# Altium schematic sheet 辉光钟_底板.SchDoc: 辉光钟
size A3; Date: 2016/12/31; CheckedBy: dudu; Author: dudu; Time: 2016/12/31; DocumentName: 辉光钟原理图
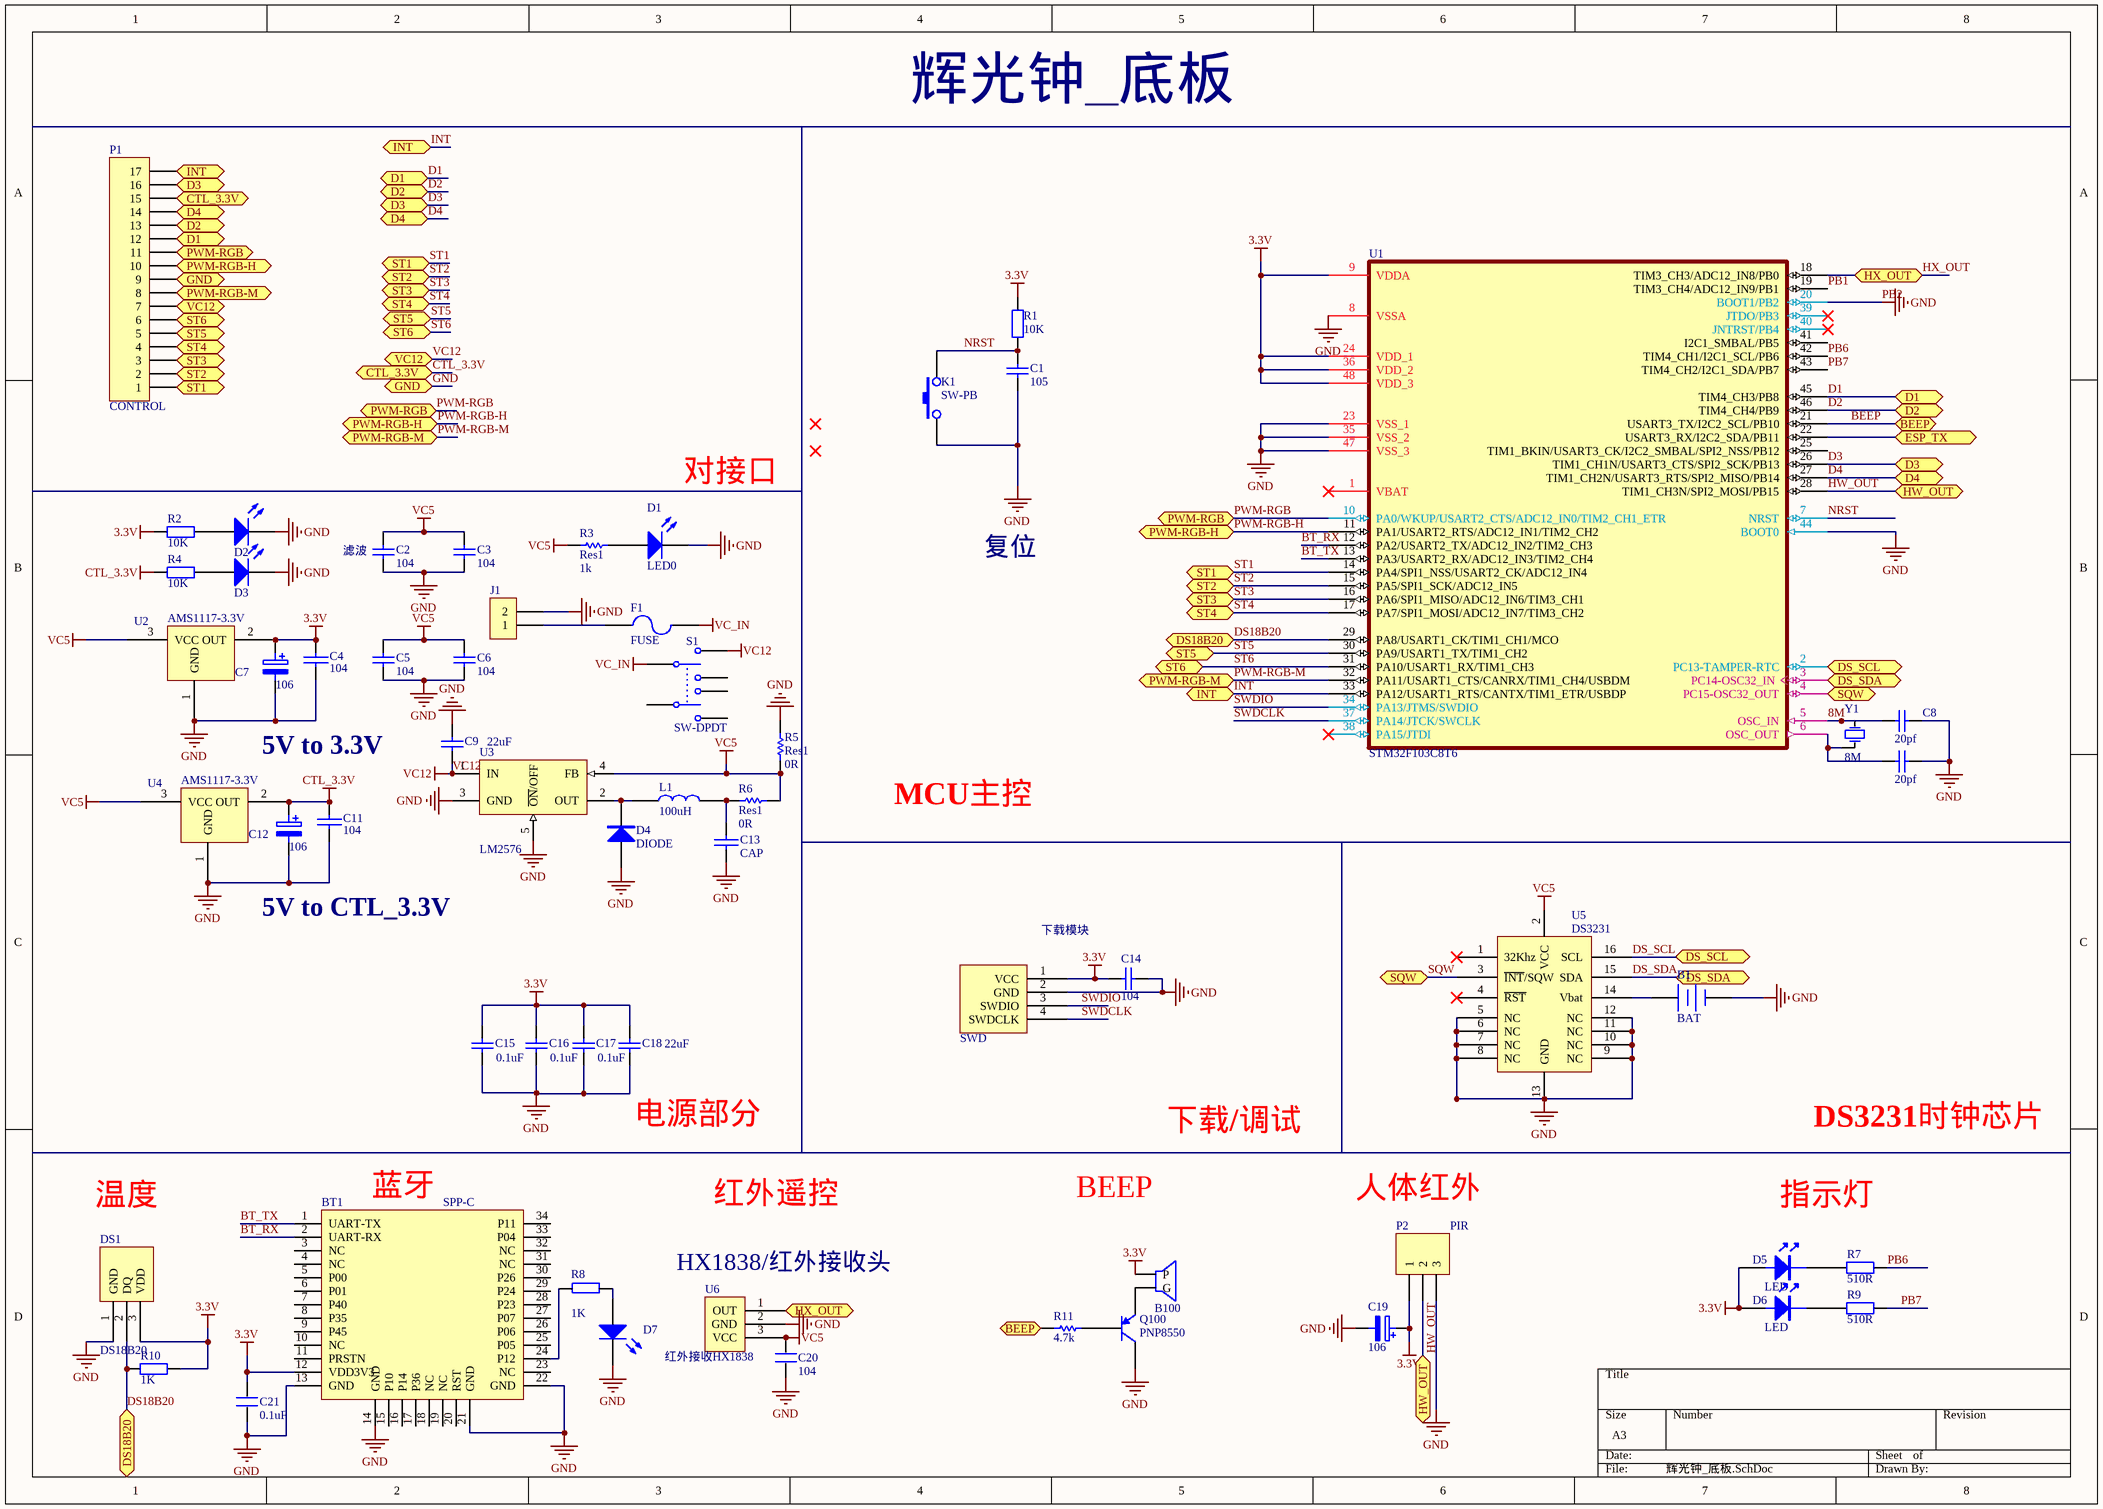
[diagram p0: 辉光钟_底板.SchDoc]

## Parts
B1  BAT  [CR1220_B]
B100  BEEP  [BELL-SMALL]  (value not drawn)
BT1  SPP-C  [CC2540/2541]
C1  105  [0603C]
C2  value 104  [0603C]  (hidden comment: Cap)
C3  value 104  [0603C]  (hidden comment: Cap)
C4  104  [0603C]
C5  value 104  [0603C]  (hidden comment: Cap)
C6  value 104  [0603C]  (hidden comment: Cap)
C7  106  [0603C]
C8  value 20pf  [0603C]  (hidden comment: Cap)
C9  value 22uF  [CD4]  (hidden comment: Cap)
C10  value 20pf  [0603C]  (hidden comment: Cap)
C11  104  [0603C]
C12  106  [0603C]
C13  CAP  [CS 5.0*10*13 - C]
C14  104  [0603C]
C15  value 0.1uF  [0603C]  (hidden comment: Cap)
C16  value 0.1uF  [0603C]  (hidden comment: Cap)
C17  value 0.1uF  [0603C]  (hidden comment: Cap)
C18  value 22uF  [0603C]  (hidden comment: Cap)
C19  106  [0603C]
C20  104  [0603C]
C21  value 0.1uF  [0603C]
D1  LED0  [0805_LED]
D2  LED0  [0805_LED]  (value not drawn)
D3  LED0  [0805_LED]  (value not drawn)
D4  DIODE  [DO-27]
D5  LED  [0805_LED]
D6  LED  [0805_LED]
D7  LED0  [0805LED]  (value not drawn)
DS1  DS18B20  [HDR1X3]
F1  FUSE  [FUSE]
J1  CON2  [DC10B]  (value not drawn)
K1  SW-PB  [KEY_M]
L1  100uH  [电感]
P1  CONTROL  [QS30_shape]
P2  PIR  [HDR1X3]
Q100  PNP8550  [NPN8050 SOT23R]
R1  10K  [0603R]
R2  value 10K  [0603R]  (hidden comment: Res1)
R3  Res1  value 1k  [0603R]
R4  value 10K  [0603R]  (hidden comment: Res1)
R5  Res1  value 0R  [0603R]
R6  Res1  value 0R  [0603R]
R7  510R  [0603R]
R8  value 1K  [0603R]
R9  510R  [0603R]
R10  value 1K  [0603R]  (hidden comment: Res1)
R11  4.7k  [0603R]
S1  SW-DPDT  [单刀双掷开关]
SWD1  SWD  [XH2.54-4]
U1  STM32F103C8T6  [STM-LQFP48_M]
U2  AMS1117-3.3V  [AMS1117_SOT223]
U3  LM2576  [TO-263-5]
U4  AMS1117-3.3V  [AMS1117_SOT223]
U5  DS3231  [SOIC-16 300mil]
U6  红外接收HX1838  [红外HX1838]
Y1  value 8M  [XTAL-12M]  (hidden comment: XTAL)

## Ports
BEEP (bidir), CTL_3.3V (bidir), D1 (bidir), D2 (bidir), D3 (bidir), D4 (bidir), DS18B20 (bidir), DS_SCL (bidir), DS_SDA (bidir), ESP_TX (bidir), GND (bidir), HW_OUT (bidir), HX_OUT (bidir), INT (bidir), PWM-RGB (bidir), PWM-RGB-H (bidir), PWM-RGB-M (bidir), SQW (bidir), ST1 (bidir), ST2 (bidir), ST3 (bidir), ST4 (bidir), ST5 (bidir), ST6 (bidir), VC12 (bidir)

## Nets
3.3V: B100.1(P) BT1.12(VDD3V3) C4.1 C7.1 C14.1 C15.2 C16.2 C17.2 C18.2 C19.1 C21.2 D5.1 D6.1 DS1.3(VDD) P2.1 R1.2 R2.2 R10.2 SWD1.1(VCC) U1.9(VDDA) U1.24(VDD_1) U1.36(VDD_2) U1.48(VDD_3) U2.2(OUT)
CTL_3.3V: C11.1 C12.1 P1.15 R4.2 U4.2(OUT) ; port CTL_3.3V
GND: B1.2(-) BT1.13(GND) BT1.14(GND) BT1.21(GND) BT1.22(GND) C1.1 C2.1 C3.1 C4.2 C5.1 C6.1 C7.2 C8.1 C9.2 C10.1 C11.2 C12.2 C13.2 C14.2 C15.1 C16.1 C17.1 C18.1 C19.2 C20.1 C21.1 D1.2(K) D2.2(K) D3.2(K) D4.A D7.2(K) DS1.1(GND) J1.2 K1.1 P1.9 P2.3 Q100.3(C) R5.2 SWD1.2(GND) U1.8(VSSA) U1.20(BOOT1/PB2) U1.23(VSS_1) U1.35(VSS_2) U1.44(BOOT0) U1.47(VSS_3) U2.1(GND) U3.3(GND) U3.5(~{ON}/OFF) U4.1(GND) U5.5(NC) U5.6(NC) U5.7(NC) U5.8(NC) U5.9(NC) U5.10(NC) U5.11(NC) U5.12(NC) U5.13(GND) U6.2(GND) ; port GND  [also labelled PB2]
VC5: C2.2 C3.2 C5.2 C6.2 C20.2 R3.2 R5.1 R6.1 U2.3(VCC) U3.4(FB) U4.3(VCC) U5.2(VCC) U6.3(VCC)
VC12: C9.1 P1.7 S1.1 U3.1(IN) ; port VC12
VC_IN: F1.2 S1.2
8M: C8.2 U1.5(OSC_IN) Y1.1(OSC1)
BEEP: R11.1 U1.21(USART3_TX/I2C2_SCL/PB10) ; port BEEP
BT_RX: BT1.2(UART-RX) U1.12(PA2/USART2_TX/ADC12_IN2/TIM2_CH3)
BT_TX: BT1.1(UART-TX) U1.13(PA3/USART2_RX/ADC12_IN3/TIM2_CH4)
D1: P1.12 U1.45(TIM4_CH3/PB8) ; port D1
D2: P1.13 U1.46(TIM4_CH4/PB9) ; port D2
D3: P1.16 U1.26(TIM1_CH1N/USART3_CTS/SPI2_SCK/PB13) ; port D3
D4: P1.14 U1.27(TIM1_CH2N/USART3_RTS/SPI2_MISO/PB14) ; port D4
DS18B20: DS1.2(DQ) R10.1 U1.29(PA8/USART1_CK/TIM1_CH1/MCO) ; port DS18B20
DS_SCL: U1.2(PC13-TAMPER-RTC) U5.16(SCL) ; port DS_SCL
DS_SDA: U1.3(PC14-OSC32_IN) U5.15(SDA) ; port DS_SDA
ESP_TX: U1.22(USART3_RX/I2C2_SDA/PB11) ; port ESP_TX
HW_OUT: P2.2 U1.28(TIM1_CH3N/SPI2_MOSI/PB15) ; port HW_OUT
HX_OUT: U1.18(TIM3_CH3/ADC12_IN8/PB0) U6.1(OUT) ; port HX_OUT
INT: P1.17 U1.33(PA12/USART1_RTS/CANTX/TIM1_ETR/USBDP) ; port INT
NRST: C1.2 K1.2 R1.1 U1.7(NRST)
PB1: U1.19(TIM3_CH4/ADC12_IN9/PB1)
PB6: R7.2 U1.42(TIM4_CH1/I2C1_SCL/PB6)
PB7: R9.2 U1.43(TIM4_CH2/I2C1_SDA/PB7)
PWM-RGB: P1.11 U1.10(PA0/WKUP/USART2_CTS/ADC12_IN0/TIM2_CH1_ETR) ; port PWM-RGB
PWM-RGB-H: P1.10 U1.11(PA1/USART2_RTS/ADC12_IN1/TIM2_CH2) ; port PWM-RGB-H
PWM-RGB-M: P1.8 U1.32(PA11/USART1_CTS/CANRX/TIM1_CH4/USBDM) ; port PWM-RGB-M
SQW: U1.4(PC15-OSC32_OUT) U5.3(~{INT}/SQW) ; port SQW
ST1: P1.1 U1.14(PA4/SPI1_NSS/USART2_CK/ADC12_IN4) ; port ST1
ST2: P1.2 U1.15(PA5/SPI1_SCK/ADC12_IN5) ; port ST2
ST3: P1.3 U1.16(PA6/SPI1_MISO/ADC12_IN6/TIM3_CH1) ; port ST3
ST4: P1.4 U1.17(PA7/SPI1_MOSI/ADC12_IN7/TIM3_CH2) ; port ST4
ST5: P1.5 U1.30(PA9/USART1_TX/TIM1_CH2) ; port ST5
ST6: P1.6 U1.31(PA10/USART1_RX/TIM1_CH3) ; port ST6
SWDCLK: SWD1.4(SWDCLK) U1.37(PA14/JTCK/SWCLK)
SWDIO: SWD1.3(SWDIO) U1.34(PA13/JTMS/SWDIO)
NetB1_1: B1.1(+) U5.14(Vbat)
NetB100_2: B100.2(G) Q100.2(E)
NetBT1_24: BT1.24(P12) R8.2
NetC10_2: C10.2 U1.6(OSC_OUT) Y1.2(OSC2)
NetC13_1: C13.1 L1.2 R6.2
NetD1_1: D1.1(A) R3.1
NetD2_1: D2.1(A) R2.1
NetD3_1: D3.1(A) R4.1
NetD4_K: D4.K L1.1 U3.2(OUT)
NetD5_2: D5.2 R7.1
NetD6_2: D6.2 R9.1
NetD7_1: D7.1(A) R8.1
NetF1_1: F1.1 J1.1
NetQ100_1: Q100.1(B) R11.2

Not connected (* = marked no-connect by the designer): BT1 3(NC) 4(NC) 5(P00) 6(P01) 7(P40) 8(P35) 9(P45) 10(NC) 11(PRSTN) 15(P10) 16(P14) 17(P36) 18(NC) 19(NC) 20(RST) 23(NC) 25(P05) 26(P06) 27(P07) 28(P23) 29(P24) 30(P26) 31(NC) 32(NC) 33(P04) 34(P11); S1 3 4(5) 5(4); U1 1(VBAT)* 25(TIM1_BKIN/USART3_CK/I2C2_SMBAL/SPI2_NSS/PB12) 38(PA15/JTDI)* 39(JTDO/PB3)* 40(JNTRST/PB4)* 41(I2C1_SMBAL/PB5); U5 1(32Khz)* 4(~{RST})*

## Notes on the sheet
- 辉光钟_底板
- (near C2) 滤波
- 复位
- 5V to 3.3V
- 5V to CTL_3.3V
- (near SWD1) 下载模块
- (near U6) HX1838/红外接收头
- Labels drawn without touching a wire or pin: BEEP, DS3231时钟芯片, MCU主控, 下载/调试, 人体红外, 对接口, 指示灯, 温度, 电源部分, 红外遥控, 蓝牙

## Library data of the parts
BT1 = SPP-C: sppc
C1 = Cap: Capacitor; Value: 104; Published: 8-Jun-2000; LatestRevisionDate: 17-Jul-2002; LatestRevisionNote: Re-released for DXP Platform.; Publisher: Altium Limited
C2 C3 C5 C6 C8 C10 = Cap: 无极性电容; Published: 8-Jun-2000; LatestRevisionDate: 17-Jul-2002; LatestRevisionNote: Re-released for DXP Platform.; PackageReference: RAD-0.3; Publisher: Altium Limited
C4 C11 = CAP: Capacitor
C7 C12 C19 = ELECTRO2
C9 C14-C18 = Cap: Capacitor; Published: 8-Jun-2000; LatestRevisionDate: 17-Jul-2002; LatestRevisionNote: Re-released for DXP Platform.; Publisher: Altium Limited
  C9 C15-C18: PackageReference: RAD-0.3
  C14: Value: 104
C20 = 0603C
C21 = C
D1 D7 = LED0: Typical INFRARED GaAs LED; Published: 8-Jun-2000; LatestRevisionDate: 08-Jul-2005; LatestRevisionNote: Mech Layer 1 removed.; PackageReference: LED-0; Publisher: Altium Limited
  D1: PackageDescription: LED; 2 Leads
D2 D3 = LED0: 发光二极管; Published: 8-Jun-2000; LatestRevisionDate: 08-Jul-2005; LatestRevisionNote: Mech Layer 1 removed.; PackageReference: LED-0; Publisher: Altium Limited
DS1 = DS18B20: 温度传感器
J1 = CON2: Connector
L1 = Inductor
P1 = Header 17: Header, 17-Pin; LatestRevisionDate: 17-Jul-2002; LatestRevisionNote: Re-released for DXP Platform.; Publisher: Altium Limited
P2 = Header 3: Header, 3-Pin; LatestRevisionDate: 17-Jul-2002; LatestRevisionNote: Re-released for DXP Platform.; Publisher: Altium Limited
R1 R7 R9 = Res2: Resistor; Published: 8-Jun-2000; LatestRevisionDate: 17-Jul-2002; LatestRevisionNote: Re-released for DXP Platform.; Publisher: Altium Limited
R2 R4 R10 = Res1: 贴片电阻; Published: 8-Jun-2000; LatestRevisionDate: 17-Jul-2002; LatestRevisionNote: Re-released for DXP Platform.; PackageReference: AXIAL-0.4; Publisher: Altium Limited
R3 R5 R6 = Res1: Resistor; Published: 8-Jun-2000; LatestRevisionDate: 17-Jul-2002; LatestRevisionNote: Re-released for DXP Platform.; PackageReference: AXIAL-0.3; Publisher: Altium Limited; PackageDescription: Axial Device, Thru-Hole; 2 Leads; 0.3 in Pin Spacing
R8 = R_1
R11 = 0603r
S1 = SW-DPDT: Double-Pole, Double-Throw Switch; Published: 24-Mar-1999; LatestRevisionDate: 17-Jul-2002; LatestRevisionNote: Re-released for DXP Platform.; PackageReference: DPDT-6; Publisher: Altium Limited; PackageDescription: Switch; 6 Leads
U1 = STM32F103C8T6: STM32 ARM-based 32-bit MCU with 64 Kbytes Flash, 48-pin LQFP, Industrial Temperature; Published: *; DatasheetVersion: *; PackageVersion: *; PackageReference: *; Publisher: *; PackageDescription: *; ComponentLink1Description: *; ComponentLink1URL: *; ComponentLink2Description: *; ComponentLink2URL: *
U2 U4 = 11
U3 = LM2576: Simple Switcher 3A Step Down Voltage Regulator; Note: Tab is connected to GND; Published: 15-Apr-2002; Datasheet: Latest Revision: Jun-1999; Package Reference: TS5B; Publisher: Altium Limited
Y1 = XTAL: 晶振; Published: 8-Jun-2000; LatestRevisionDate: 17-Jul-2002; LatestRevisionNote: Re-released for DXP Platform.; PackageReference: R38; Publisher: Altium Limited